# Altium schematic sheet 4-CPUMipiXo.SchDoc
size 431 x 279 mm; Organization: ORGANIZATION; Address1: ADDRESS 1; Address2: ADDRESS 2; Address3: ADDRESS 3; Address4: ADDRESS 4; DocumentNumber: 4; Revision: -; SheetNumber: 4; SheetTotal: 14; ENG_APP_DATE: --/--/--; DSN_APP_DATE: --/--/--; CHK_APP_DATE: --/--/--
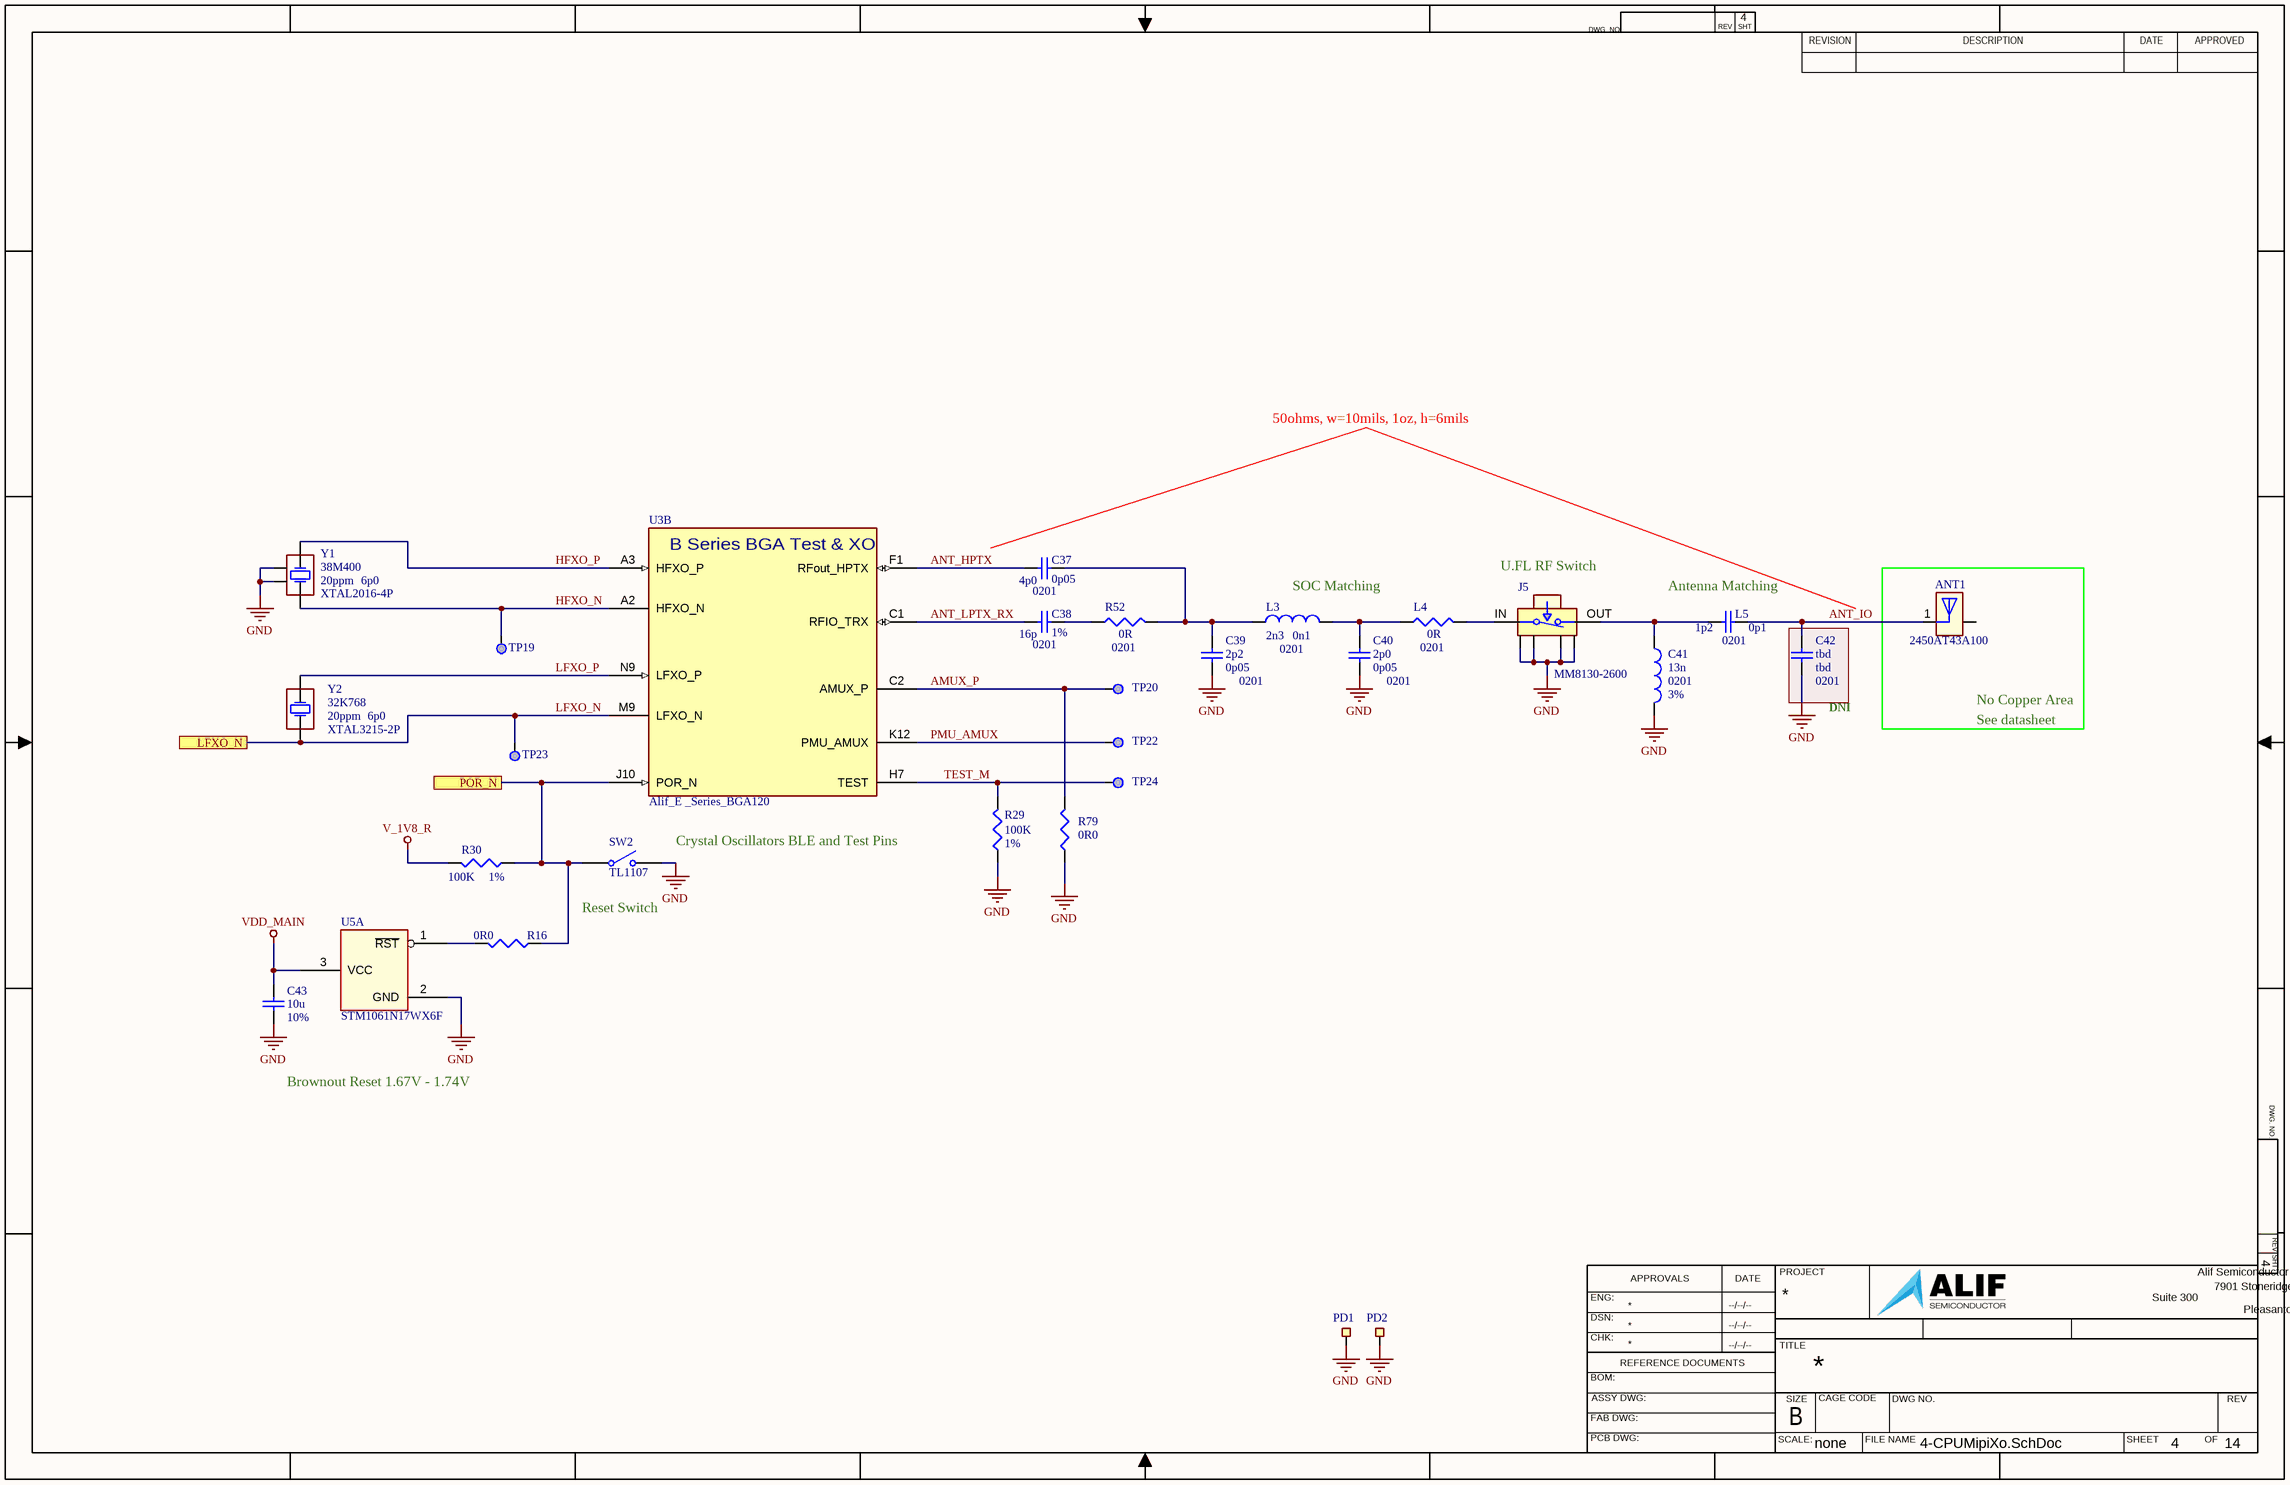
[diagram p0: 4-CPUMipiXo.SchDoc]

## Parts
ANT1  2450AT43A100  [ANT_JOT_2450AT43A100_JOD]
C37  value 4p0  PCB_Footprint: 0201  Tolerance: 0p05  [CC0201_RF10]  (hidden comment: Cap)
C38  value 16p  PCB_Footprint: 0201  Tolerance: 1%  [CC0201_RF10]  (hidden comment: Cap)
C39  value 2p2  PCB_Footprint: 0201  Tolerance: 0p05  [CC0201_RF10]  (hidden comment: Cap)
C40  value 2p0  PCB_Footprint: 0201  Tolerance: 0p05  [CC0201_RF10]  (hidden comment: Cap)
C41  value 13n  PCB_Footprint: 0201  Tolerance: 3%  [LC0201_RF10]  (hidden comment: Inductor)
C42  value tbd  PCB_Footprint: 0201  Tolerance: tbd  [CC0201_RF10]  (hidden comment: Cap)
C43  value 10u  Tolerance: 10%  [CAPC0402-01]  (hidden comment: Cap)
J5  MM8130-2600  [CONN_U.FL_SWITCH_MURATA_MM8130-2600RA2]
L3  value 2n3  PCB_Footprint: 0201  Tolerance: 0n1  [LC0201_RF10]  (hidden comment: Inductor)
L4  value 0R  PCB_Footprint: 0201  [RC0201_RF10]  (hidden comment: Res3)
L5  value 1p2  PCB_Footprint: 0201  Tolerance: 0p1  [CC0201_RF10]  (hidden comment: Cap)
PD1  PAD_10x10  [PAD_RF10x10]  (value not drawn)  (no BOM)
PD2  PAD_10x10  [PAD_RF10x10]  (value not drawn)  (no BOM)
R16  value 0R0  [RESC0402-01]  (hidden comment: Res3)
R29  value 100K  Tolerance: 1%  [RESC0402-01]  (hidden comment: Res3)
R30  value 100K  Tolerance: 1%  [RESC0402-01]  (hidden comment: Res3)
R52  value 0R  PCB_Footprint: 0201  [RC0201_RF10]  (hidden comment: Res3)
R79  value 0R0  [RESC0402-01]  (hidden comment: Res3)
SW2  value TL1107  [SW_1825966-TL1107-1]  (hidden comment: SW-SPST)
TP19  TP_SMPAD  [TP_30_RND]  (value not drawn)  (no BOM)
TP20  TP_SMPAD  [TP_30_RND]  (value not drawn)  (no BOM)
TP22  TP_SMPAD  [TP_30_RND]  (value not drawn)  (no BOM)
TP23  TP_SMPAD  [TP_30_RND]  (value not drawn)  (no BOM)
TP24  TP_SMPAD  [TP_30_RND]  (value not drawn)  (no BOM)
U3  Alif_E _Series_BGA120  [BGA120_socket-NO_SOCK_3D]  (part B of 4)
U5  STM1061N17WX6F  [SOT-23_DBZ_TEX]  (part A of 2)
Y1  value 38M400  PCB_Footprint: XTAL2016-4P  PPM: 20ppm  Load Cap: 6p0  [OSC_4p_2016_XRCGB38M400F2P00R0]  (hidden comment: Xtal_38M4_20PPM6PF_2016-4P_1)
Y2  value 32K768  PCB_Footprint: XTAL3215-2P  PPM: 20ppm  Load Cap: 6p0  [XTAL_ABS07_ABR-M]  (hidden comment: Xtal_32K768_20PPM6PF_3215-2P_1)

## Ports
LFXO_N, POR_N

## Nets
GND: C39.1 C40.1 C41.2 C42.1 C43.1 J5.G1 J5.G2 J5.G3 J5.G4 PD1.1 PD2.1 R29.1 R79.1 SW2.2(NO) U5.2(GND) Y1.2 Y1.4
V_1V8_R: R30.2
VDD_MAIN: C43.2 U5.3(VCC)
AMUX_P: R79.2 TP20.1 U3.C2(AMUX_P)
ANT_HPTX: C37.2 U3.F1(RFout_HPTX)
ANT_IO: ANT1.1(INPUT) C42.2 L5.1
ANT_LPTX_RX: C38.2 U3.C1(RFIO_TRX)
HFXO_N: TP19.1 U3.A2(HFXO_N) Y1.3(OSC2)
HFXO_P: U3.A3(HFXO_P) Y1.1(OSC1)
LFXO_N: TP23.1 U3.M9(LFXO_N) Y2.1(OSC1) ; port LFXO_N
LFXO_P: U3.N9(LFXO_P) Y2.2(OSC2)
PMU_AMUX: TP22.1 U3.K12(PMU_AMUX)
POR_N: R16.1 R30.1 SW2.1(COMMON) U3.J10(POR_N) ; port POR_N
TEST_M: R29.2 TP24.1 U3.H7(TEST)
NetC37_1: C37.1 C39.2 L3.1 R52.2
NetC38_1: C38.1 R52.1
NetC40_2: C40.2 L3.2 L4.1
NetC41_1: C41.1 J5.OUT L5.2
NetJ5_IN: J5.IN L4.2
NetR16_2: R16.2 U5.1(~{RST})

Not connected (* = marked no-connect by the designer): ANT1 3(GND)

## Notes on the sheet
- 50ohms, w=10mils, 1oz, h=6mils
- U.FL RF Switch
- SOC Matching
- (near L5) Antenna Matching
- No Copper Area
- (near C42) DNI
- See datasheet
- Crystal Oscillators BLE and Test Pins
- Reset Switch
- Brownout Reset 1.67V - 1.74V
- DWG. NO.
- REV
- SHT
- REVISION
- DESCRIPTION
- DATE
- APPROVED
- ENG:
- APPROVALS
- PROJECT
- Suite 300
- Alif Semiconductor
- 7901 Stoneridge Drive
- DSN:
- CHK:
- REFERENCE DOCUMENTS
- TITLE
- Pleasanton, CA 94588  USA
- BOM:
- FAB DWG:
- PCB DWG:
- ASSY DWG:
- SCALE:
- SIZE
- B
- CAGE CODE
- FILE NAME
- DWG NO.
- SHEET
- OF
- none
- (in symbol SPARK_B1_120BGA_A5, part B) B Series BGA Test & XO

## Library data of the parts
ANT1 = ANT_2450AT43A100: Antenna, Chip, 2.4GHz Bluetooth, ISM, Wi-Fi,  2.7dBi; Manufacturer 1: Johanson; Manufacturer Part Number 1: 2450AT43A0100001E; SnapEDA_Link: https://www.snapeda.com/parts/ACAG0201-2450-T/Abracon+LLC/view-part/?ref=snap; Package: None; Value: *; Check_prices: https://www.snapeda.com/parts/ACAG0201-2450-T/Abracon+LLC/view-part/?ref=eda
C37 = Cap_SMT: Cap,4.0pF,+-0.05pF,>=25V,C0G,0201; Manufacturer 1: MuRata; Manufacturer Part Number 1: GJM0335C1E4R0WB01D; Voltage: 25V; Published: 8-Jun-2000; LatestRevisionDate: 17-Jul-2002; LatestRevisionNote: Re-released for DXP Platform.; PackageReference: RAD-0.3; Publisher: Altium Limited; PackageDescription: Radial Cap, Thru-Hole; 2 Leads; 0.3 in Pin Spacing; Max_Height: 0.60mm; Manufacturer 2: Kemet; Manufacturer Part Number 2: CBR02C409A5GAC; Manufacturer 3: *; Manufacturer Part Number 3: *; Type: C0G
C38 = Cap_SMT: Cap,16pF,1%,50V,C0G,0201; Manufacturer 1: MuRata; Manufacturer Part Number 1: GCM0335C1H160FA16J; Voltage: 25V; Published: 8-Jun-2000; LatestRevisionDate: 17-Jul-2002; LatestRevisionNote: Re-released for DXP Platform.; PackageReference: RAD-0.3; Publisher: Altium Limited; PackageDescription: Radial Cap, Thru-Hole; 2 Leads; 0.3 in Pin Spacing; Max_Height: 0.60mm; Manufacturer 2: Kemet; Manufacturer Part Number 2: CBR02C160F8GAC; Manufacturer 3: *; Manufacturer Part Number 3: *; Type: C0G
C39 = Cap_SMT: Cap,2.2pF,+-0.05pF,>25V,C0G,0201; Manufacturer 1: MuRata; Manufacturer Part Number 1: GJM0335C1E2R2WB01D; Voltage: 25V; Published: 8-Jun-2000; LatestRevisionDate: 17-Jul-2002; LatestRevisionNote: Re-released for DXP Platform.; PackageReference: RAD-0.3; Publisher: Altium Limited; PackageDescription: Radial Cap, Thru-Hole; 2 Leads; 0.3 in Pin Spacing; Max_Height: 0.60mm; Manufacturer 2: Kemet; Manufacturer Part Number 2: CBR02C229A5GAC; Manufacturer 3: *; Manufacturer Part Number 3: *; Type: C0G
C40 = Cap_SMT: Cap,2.0pF,+-0.05pF,>25V,C0G,0201; Manufacturer 1: MuRata; Manufacturer Part Number 1: GJM0335C1E2R0WB01D; Voltage: 25V; Published: 8-Jun-2000; LatestRevisionDate: 17-Jul-2002; LatestRevisionNote: Re-released for DXP Platform.; PackageReference: RAD-0.3; Publisher: Altium Limited; PackageDescription: Radial Cap, Thru-Hole; 2 Leads; 0.3 in Pin Spacing; Max_Height: 0.60mm; Manufacturer 2: Yageo; Manufacturer Part Number 2: CQ0201ARNPO9BN2R0; Manufacturer 3: *; Manufacturer Part Number 3: *; Type: C0G
C41 = Inductor: Ind,13nH,+-3%,>300mA,ESR < 800mOhm,SRF >4.3GHz,Q >12 @ 500MHz,0201; Manufacturer 1: MuRata; Manufacturer Part Number 1: LQP03TN13NH02D; DCR: 800m; RMS_Current: 250mA; Published: 8-Jun-2000; LatestRevisionDate: 29-May-2009; LatestRevisionNote: IPC-7351 Footprint Added.; PackageReference: 0402-A; Publisher: Altium Limited; PackageDescription: Chip Inductor; Code_JEITA: 0201; Code_IEC: 0201; Sat_Current: *; Impedance: *; Type: *; Manufacturer 2: MuRata; Manufacturer Part Number 2: LQP03HQ13NH02D; Manufacturer 3: Abracon; Manufacturer Part Number 3: AIMC-Q0201HQ-13NH-T; Max_Height: 0.45mm
C42 = Cap_SMT: DNI,Cap,tbd,tbd,>25V,C0G,0201; Voltage: 25V; Published: 8-Jun-2000; LatestRevisionDate: 17-Jul-2002; LatestRevisionNote: Re-released for DXP Platform.; PackageReference: RAD-0.3; Publisher: Altium Limited; PackageDescription: Radial Cap, Thru-Hole; 2 Leads; 0.3 in Pin Spacing; Max_Height: 0.60mm; Manufacturer 1: *; Manufacturer Part Number 1: *; Manufacturer 2: *; Manufacturer Part Number 2: *; Manufacturer 3: *; Manufacturer Part Number 3: *; Type: C0G
C43 = Cap: Cap,10uF,20%,10V,X5R,0402; Manufacturer 1: AVX; Manufacturer Part Number 1: 0402ZD106MAT2A; PCB_Footprint: CC0402; Published: 8-Jun-2000; LatestRevisionDate: 17-Jul-2002; LatestRevisionNote: Re-released for DXP Platform.; PackageReference: RAD-0.3; Publisher: Altium Limited; PackageDescription: Radial Cap, Thru-Hole; 2 Leads; 0.3 in Pin Spacing; Max_Height: 0.60mm; Manufacturer 2: Samsung; Manufacturer Part Number 2: CL05A106MP5NUNC; Manufacturer 3: Venkel; Manufacturer Part Number 3: C0402X5R100-106MNP; Type: X5R; Voltage: 10V
J5 = CONN_U.FL_SWITCH_MM8130-2600: Conn,U.FL, Switch, Male Pin 50Ohm 6-Pin SMT; Manufacturer 1: MyRata; Manufacturer Part Number 1: MM8130-2600R; Datasheet Link: https://www.te.com/commerce/DocumentDelivery/DDEController?Action=showdoc&DocId=Customer+Drawing%7F2081956%7FA%7Fpdf%7FEnglish%7FENG_CD_2081956_A.pdf%7F2081956-1; Height: 1.05mm
L3 = Inductor: Ind,2.3nH,+-0.1nH,>500mA,ESR < 250mOhm,SRF >7GHz,Q >20 @ 500MHz,0201; Manufacturer 1: MuRata; Manufacturer Part Number 1: LQP03HQ2N3B02D; DCR: 170m; RMS_Current: 500mA; Published: 8-Jun-2000; LatestRevisionDate: 29-May-2009; LatestRevisionNote: IPC-7351 Footprint Added.; PackageReference: 0402-A; Publisher: Altium Limited; PackageDescription: Chip Inductor; Code_JEITA: 0201; Code_IEC: 0201; Sat_Current: *; Impedance: *; Type: *; Manufacturer 2: TDK; Manufacturer Part Number 2: MHQ0603P2N3BT000; Manufacturer 3: *; Manufacturer Part Number 3: *; Max_Height: 0.45mm
L4 = Res3: Res,0R ohm,Jumper,0201; Manufacturer 1: KOA; Manufacturer Part Number 1: RK73Z1HTTC; Wattage: 50mW; Type: Thick Film; Tolerance: 1%; Published: 8-Jun-2000; LatestRevisionDate: 29-May-2009; LatestRevisionNote: IPC-7351 Footprint Added.; PackageReference: 0201; Publisher: Altium Limited; PackageDescription: Chip Resistor; Voltage: *; Manufacturer 2: Stackpol; Manufacturer Part Number 2: RMCF0201ZT0R00; Manufacturer 3: Panasonic; Manufacturer Part Number 3: ERJ-1GN0R00C
L5 = Cap_SMT: Cap,1.2pF,<+-0.10pF,25-50V,C0G,0201; Manufacturer 1: MuRata; Manufacturer Part Number 1: GJM0335C1E1R2BB01D; Voltage: 50V; Published: 8-Jun-2000; LatestRevisionDate: 17-Jul-2002; LatestRevisionNote: Re-released for DXP Platform.; PackageReference: RAD-0.3; Publisher: Altium Limited; PackageDescription: Radial Cap, Thru-Hole; 2 Leads; 0.3 in Pin Spacing; Max_Height: 0.60mm; Manufacturer 2: Kemet; Manufacturer Part Number 2: CBR02C129B3GAC; Manufacturer 3: Kyosera; Manufacturer Part Number 3: CU01311R2BAT2A; Type: C0G
PD1 PD2 = PAD_0101: Test Point, SMT Pad,--not a BOM item--; PCB_Footprint: TP_PAD10x10
R16 R79 = Res3: Res,0R ohm,Jumper,0402; Manufacturer 1: Stackpol; Manufacturer Part Number 1: RMCF0402ZT0R00; Wattage: 63mW; Tolerance: JMPR; Published: 8-Jun-2000; LatestRevisionDate: 29-May-2009; LatestRevisionNote: IPC-7351 Footprint Added.; PackageReference: RESC0402-01; Publisher: Altium Limited; PackageDescription: Chip Resistor; Voltage: *; Type: Thick Film; Manufacturer 2: Yageo; Manufacturer Part Number 2: RC0402FR-070RL; Manufacturer 3: Panasonic; Manufacturer Part Number 3: ERJ-XGN0R00Y; PCB_Footprint: RESC0402-01
R29 R30 = Res3: Res,100K,1%,100ppm,0402; Manufacturer 1: Stackpol; Manufacturer Part Number 1: RMCF0402FT100K; Wattage: 63mW; Published: 8-Jun-2000; LatestRevisionDate: 29-May-2009; LatestRevisionNote: IPC-7351 Footprint Added.; PackageReference: RESC0402-01; Publisher: Altium Limited; PackageDescription: Chip Resistor; Voltage: *; Type: Thick Film; Manufacturer 2: Yageo; Manufacturer Part Number 2: RC0402FR-07100KL; Manufacturer 3: Bourns; Manufacturer Part Number 3: CR0402-FX-1003GLF; PCB_Footprint: RESC0402-01
R52 = Res3: Res,0R ohm,Jumper,0201; Manufacturer 1: KOA; Manufacturer Part Number 1: RK73Z1HTTC; Wattage: 50mW; Tolerance: 1%; Published: 8-Jun-2000; LatestRevisionDate: 29-May-2009; LatestRevisionNote: IPC-7351 Footprint Added.; PackageReference: 0201; Publisher: Altium Limited; PackageDescription: Chip Resistor; Voltage: *; Type: Thick Film; Manufacturer 2: Stackpol; Manufacturer Part Number 2: RMCF0201ZT0R00; Manufacturer 3: Panasonic; Manufacturer Part Number 3: ERJ-1GN0R00C
SW2 = SW-SPST: Swit, SPST, Momentary Pushputton, 2 pin, 6.0x3.5mm, H=5.0mm; Manufacturer 1: E-Switch; Manufacturer Part Number 1: TL1107BF180WQ; Published: 24-Mar-1999; LatestRevisionDate: 17-Jul-2002; LatestRevisionNote: Re-released for DXP Platform.; PackageReference: SPST-2; Publisher: Altium Limited; PackageDescription: Switch; 2 Leads; Manufacturer 2: C&K; Manufacturer Part Number 2: PTS636 SM50 LFS; Manufacturer 3: Panasonic; Manufacturer Part Number 3: EVQ-PE505K
TP19 TP20 TP22-TP24 = TP_SMPAD: Test Point, SMT Pad,--not a BOM item--; PCB_Footprint: TP_PAD1
U3 = SPARK_B1_120BGA_A5: IC,Alif Spark B1 MCU, Rev A5 silicon,BGA120; Manufacturer 1: Alif Semi; Manufacturer Part Number 1: AB1C1F4M51820PH0
U5 = IC_SUP_STM1061N17WX6F: IC,PMIC Volt Supervisor, -Reset OD, 1.7V, 2%, 900nA, SOT23-3; Manufacturer 1: ST Micro; Manufacturer Part Number 1: STM1061N17WX6F; Manufacturer 2: *; Manufacturer Part Number 2: *
Y1 = Xtal_38M4_20PPM6PF_2016-4P_1: Crystal,38.4MHz,20ppm,6.0pF,100ohm,2016-4pin; Manufacturer 1: Murata; Manufacturer Part Number 1: XRCGB38M400F2P00R0; ESR: 100; Published: 8-Jun-2000; LatestRevisionDate: 17-Jul-2002; LatestRevisionNote: Re-released for DXP Platform.; PackageReference: R38; Publisher: Altium Limited; PackageDescription: Crystal, Thru-Hole; 2 Leads; Body 3.1 x 8.2 mm (Dia.xH); Max_Height: 0.65mm
Y2 = Xtal_32K768_20PPM6PF_3215-2P_1: Crystal, 32.768KHz, 20ppm, 6pF, <70Kohm, 3215-2pin; Manufacturer 1: Epson; Manufacturer Part Number 1: FC-135R 32.7680KF-E; ESR: 70Kohm; Published: 8-Jun-2000; LatestRevisionDate: 17-Jul-2002; LatestRevisionNote: Re-released for DXP Platform.; PackageReference: R38; Publisher: Altium Limited; PackageDescription: Crystal, Thru-Hole; 2 Leads; Body 3.1 x 8.2 mm (Dia.xH); Max_Height: 0.60mm; Manufacturer 2: Abracon; Manufacturer Part Number 2: ABS07-32.768KHZ-6-T